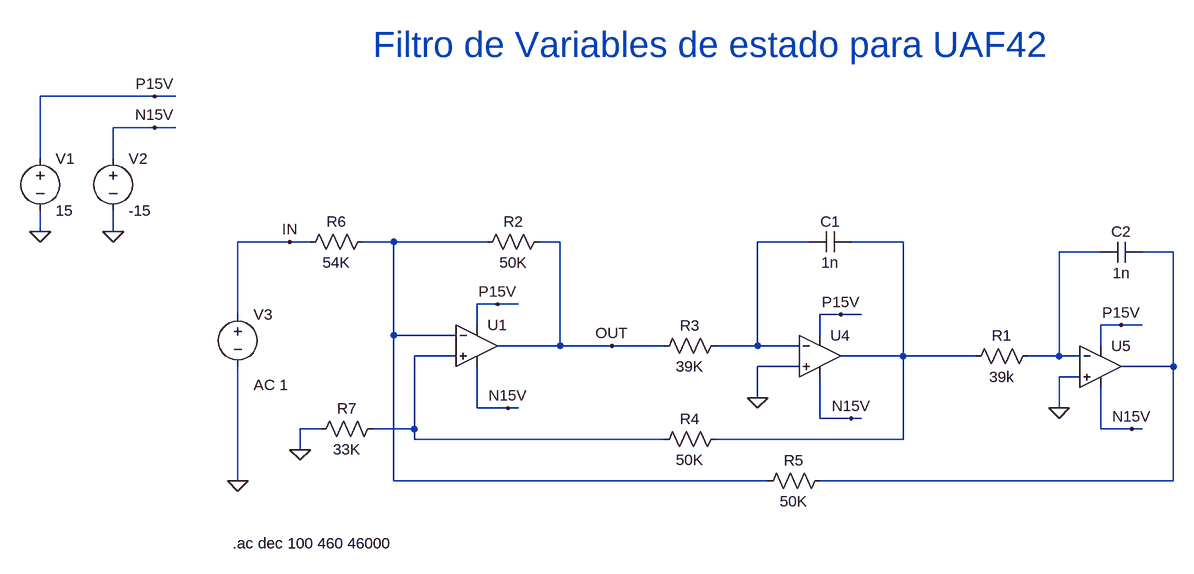
[diagram p0: schematic TPL1_Simulacion_Circuital_V1.1.asc]
TPL1_Simulacion_Circuital_V1.1.asc, the LTspice schematic file:
Version 4
SHEET 1 996 680
WIRE -672 -256 -848 -256
WIRE -640 -256 -672 -256
WIRE -672 -208 -736 -208
WIRE -640 -208 -672 -208
WIRE -848 -160 -848 -256
WIRE -736 -160 -736 -208
WIRE -848 -48 -848 -80
WIRE -736 -48 -736 -80
WIRE -464 -32 -544 -32
WIRE -432 -32 -464 -32
WIRE -304 -32 -352 -32
WIRE -160 -32 -304 -32
WIRE -48 -32 -80 -32
WIRE 336 -32 256 -32
WIRE 480 -32 400 -32
WIRE 784 -16 720 -16
WIRE 896 -16 848 -16
WIRE -144 64 -176 64
WIRE -112 64 -144 64
WIRE -544 80 -544 -32
WIRE 384 80 352 80
WIRE 416 80 384 80
WIRE -176 96 -176 64
WIRE 816 96 784 96
WIRE 848 96 816 96
WIRE -304 112 -304 -32
WIRE -208 112 -304 112
WIRE 352 112 352 80
WIRE -48 128 -48 -32
WIRE -48 128 -144 128
WIRE 32 128 -48 128
WIRE 112 128 32 128
WIRE 256 128 256 -32
WIRE 256 128 192 128
WIRE 320 128 256 128
WIRE 784 128 784 96
WIRE -208 144 -272 144
WIRE 480 144 480 -32
WIRE 480 144 384 144
WIRE 592 144 480 144
WIRE 720 144 720 -16
WIRE 720 144 672 144
WIRE 752 144 720 144
WIRE 320 160 256 160
WIRE 896 160 896 -16
WIRE 896 160 816 160
WIRE 752 176 720 176
WIRE 256 208 256 160
WIRE -176 224 -176 160
WIRE -128 224 -176 224
WIRE -112 224 -128 224
WIRE 720 224 720 176
WIRE 352 240 352 176
WIRE 400 240 352 240
WIRE 416 240 400 240
WIRE -416 256 -448 256
WIRE -272 256 -272 144
WIRE -272 256 -336 256
WIRE 784 256 784 192
WIRE 832 256 784 256
WIRE 848 256 832 256
WIRE -272 272 -272 256
WIRE 112 272 -272 272
WIRE 480 272 480 144
WIRE 480 272 192 272
WIRE -448 288 -448 256
WIRE -544 336 -544 160
WIRE -304 336 -304 112
WIRE 272 336 -304 336
WIRE 896 336 896 160
WIRE 896 336 352 336
FLAG -848 -48 0
FLAG -736 -48 0
FLAG -672 -256 P15V
FLAG -672 -208 N15V
FLAG -144 64 P15V
FLAG -128 224 N15V
FLAG 384 80 P15V
FLAG 400 240 N15V
FLAG 816 96 P15V
FLAG 832 256 N15V
FLAG 256 208 0
FLAG 720 224 0
FLAG 32 128 OUT
FLAG -464 -32 IN
FLAG -544 336 0
FLAG -448 288 0
SYMBOL voltage -848 -176 R0
WINDOW 123 0 0 Left 2
WINDOW 39 0 0 Left 2
SYMATTR InstName V1
SYMATTR Value 15
SYMBOL voltage -736 -176 R0
WINDOW 123 0 0 Left 2
WINDOW 39 0 0 Left 2
SYMATTR InstName V2
SYMATTR Value -15
SYMBOL res 688 128 R90
WINDOW 0 0 56 VBottom 2
WINDOW 3 32 56 VTop 2
SYMATTR InstName R1
SYMATTR Value 39k
SYMBOL res -64 -48 R90
WINDOW 0 0 56 VBottom 2
WINDOW 3 32 56 VTop 2
SYMATTR InstName R2
SYMATTR Value 50K
SYMBOL res 208 112 R90
WINDOW 0 0 56 VBottom 2
WINDOW 3 32 56 VTop 2
SYMATTR InstName R3
SYMATTR Value 39K
SYMBOL cap 400 -48 R90
WINDOW 0 0 32 VBottom 2
WINDOW 3 32 32 VTop 2
SYMATTR InstName C1
SYMATTR Value 1n
SYMBOL res 208 256 R90
WINDOW 0 0 56 VBottom 2
WINDOW 3 32 56 VTop 2
SYMATTR InstName R4
SYMATTR Value 50K
SYMBOL cap 848 -32 R90
WINDOW 0 0 32 VBottom 2
WINDOW 3 32 32 VTop 2
SYMATTR InstName C2
SYMATTR Value 1n
SYMBOL res 368 320 R90
WINDOW 0 0 56 VBottom 2
WINDOW 3 32 56 VTop 2
SYMATTR InstName R5
SYMATTR Value 50K
SYMBOL res -336 -48 R90
WINDOW 0 0 56 VBottom 2
WINDOW 3 32 56 VTop 2
SYMATTR InstName R6
SYMATTR Value 54K
SYMBOL voltage -544 64 R0
WINDOW 123 24 124 Left 2
WINDOW 39 0 0 Left 2
SYMATTR Value2 AC 1
SYMATTR InstName V3
SYMATTR Value ""
SYMBOL res -320 240 R90
WINDOW 0 0 56 VBottom 2
WINDOW 3 32 56 VTop 2
SYMATTR InstName R7
SYMATTR Value 33K
SYMBOL OpAmps\\UniversalOpAmp -176 128 R0
SYMATTR InstName U1
SYMBOL OpAmps\\UniversalOpAmp 352 144 R0
SYMATTR InstName U4
SYMBOL OpAmps\\UniversalOpAmp 784 160 R0
SYMATTR InstName U5
TEXT -552 432 Left 2 !.ac dec 100 460 46000
TEXT -336 -336 Left 5 ;Filtro de Variables de estado para UAF42

The netlist it stands for:
* TPL1_Simulacion_Circuital_V1.1.asc
V1 P15V 0 15
V2 N15V 0 -15
R1 N004 N003 39k
R2 OUT N001 50K
R3 N002 OUT 39K
C1 N003 N002 1n
R4 N003 N006 50K
C2 N005 N004 1n
R5 N005 N001 50K
R6 N001 IN 54K
V3 IN 0 AC 1
R7 N006 0 33K
XU1 N006 N001 P15V N15V OUT level1 Avol=1Meg GBW=10Meg Vos=0 En=0 Enk=0 In=0 Ink=0 Rin=500Meg  ; pins In+ In- V+ V- OUT
XU4 0 N002 P15V N15V N003 level1 Avol=1Meg GBW=10Meg Vos=0 En=0 Enk=0 In=0 Ink=0 Rin=500Meg  ; pins In+ In- V+ V- OUT
XU5 0 N004 P15V N15V N005 level1 Avol=1Meg GBW=10Meg Vos=0 En=0 Enk=0 In=0 Ink=0 Rin=500Meg  ; pins In+ In- V+ V- OUT
.ac dec 100 460 46000
* Filtro de Variables de estado para UAF42
.lib UniversalOpAmp1.lib
.backanno
.end